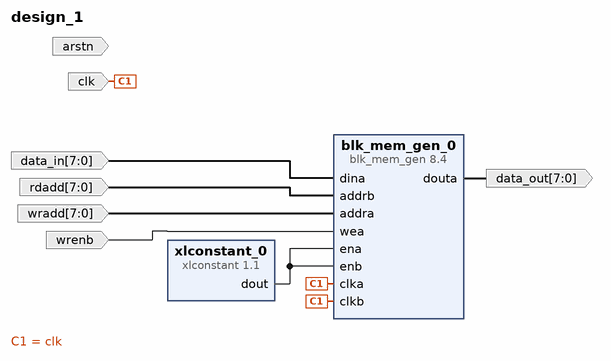
[diagram p0: block diagram of the top level]
# Vivado block design design_1, xc7a100ticsg324-1L, Vivado 2023.2.2
create_bd_design design_1

create_bd_port -dir I -type clk clk
set_property -dict {CONFIG.FREQ_HZ 40000000} [get_bd_ports clk]
create_bd_port -dir I -type rst arstn
create_bd_port -dir I wrenb
create_bd_port -dir I -from 7 -to 0 wradd
create_bd_port -dir I -from 7 -to 0 rdadd
create_bd_port -dir I -from 7 -to 0 data_in
create_bd_port -dir O -from 7 -to 0 data_out

create_bd_cell -type ip -vlnv xilinx.com:ip:blk_mem_gen:8.4 blk_mem_gen_0
set_property -dict [list \
  CONFIG.Memory_Type True_Dual_Port_RAM \
  CONFIG.Operating_Mode_B READ_FIRST \
  CONFIG.Register_PortA_Output_of_Memory_Primitives false \
  CONFIG.Register_PortB_Output_of_Memory_Primitives false \
  CONFIG.Use_Byte_Write_Enable false \
  CONFIG.Write_Depth_A 256 \
  CONFIG.Write_Width_A 8 \
  CONFIG.use_bram_block Stand_Alone \
] [get_bd_cells blk_mem_gen_0]
create_bd_cell -type ip -vlnv xilinx.com:ip:xlconstant:1.1 xlconstant_0

# ---- connections ----

connect_bd_net [get_bd_pins blk_mem_gen_0/douta] [get_bd_ports data_out]
connect_bd_net [get_bd_ports clk] [get_bd_pins blk_mem_gen_0/clka] [get_bd_pins blk_mem_gen_0/clkb]
connect_bd_net [get_bd_ports data_in] [get_bd_pins blk_mem_gen_0/dina]
connect_bd_net [get_bd_ports rdadd] [get_bd_pins blk_mem_gen_0/addrb]
connect_bd_net [get_bd_ports wradd] [get_bd_pins blk_mem_gen_0/addra]
connect_bd_net [get_bd_ports wrenb] [get_bd_pins blk_mem_gen_0/wea]
connect_bd_net [get_bd_pins xlconstant_0/dout] [get_bd_pins blk_mem_gen_0/ena] [get_bd_pins blk_mem_gen_0/enb]

validate_bd_design
save_bd_design
